# Altium schematic sheet jetson-nano.SchDoc
size A3
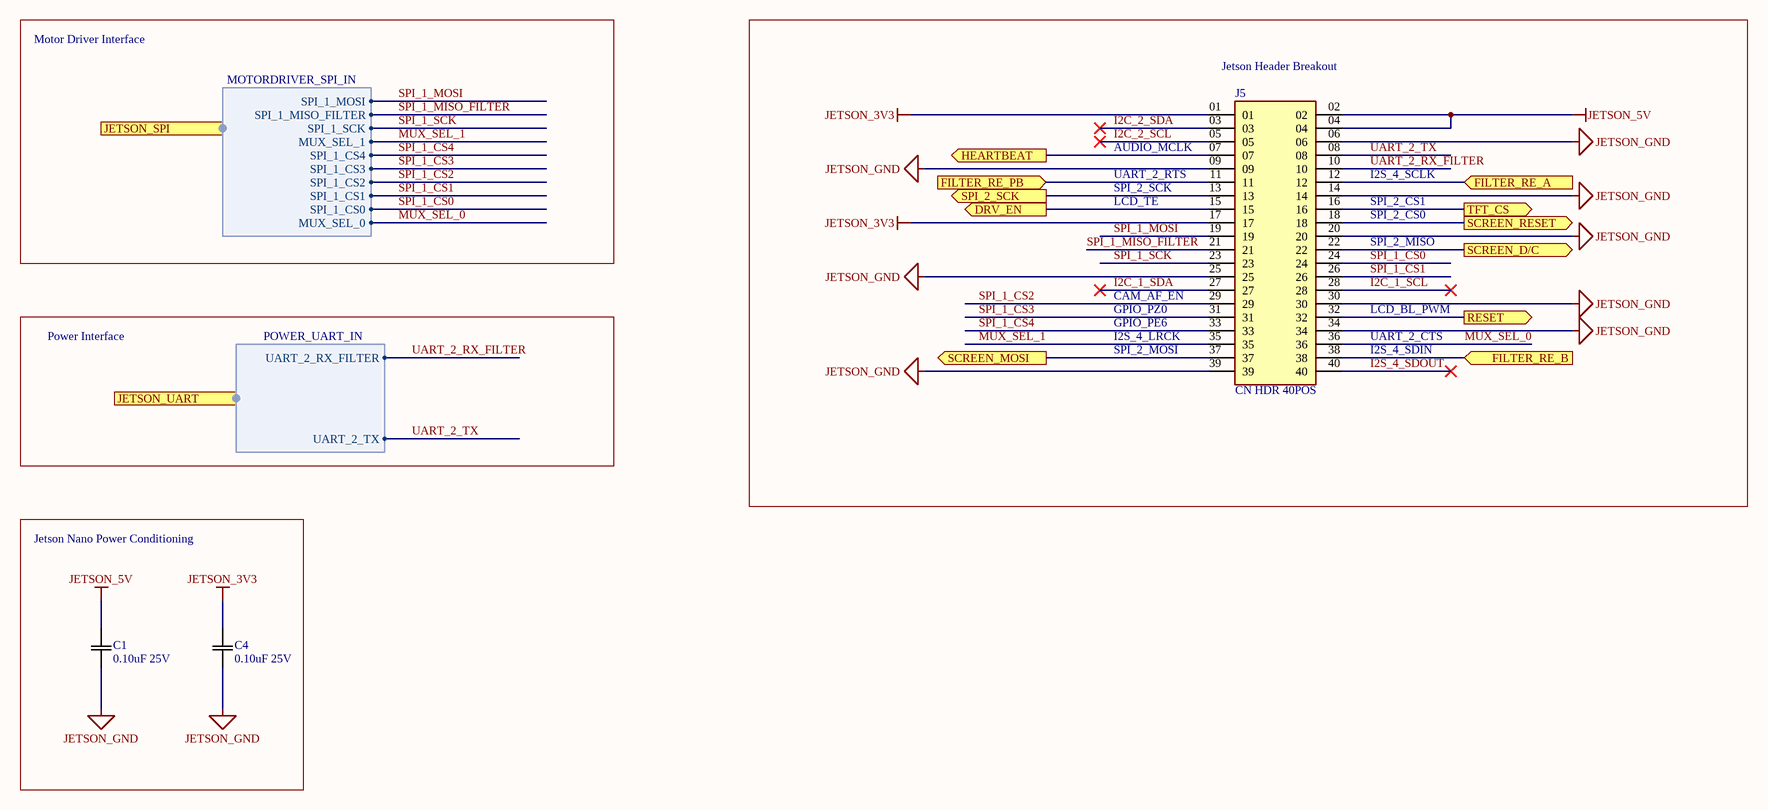
[diagram p0: jetson-nano.SchDoc]

## Parts
C1  0.10uF 25V  [0805]
C4  0.10uF 25V  [0805]
J5  CN HDR 40POS  [CN HDR 40POS 0.1 TH]

## Blocks framed on the sheet
Jetson Nano Power Conditioning: C1 C4

## Ports
DRV_EN (out), FILTER_RE_A (in), FILTER_RE_B (in), FILTER_RE_PB (in), HEARTBEAT (out), JETSON_SPI (harness MOTORDRIVER_SPI_IN), JETSON_UART (harness POWER_UART_IN), RESET (out), SCREEN_D/C (out), SCREEN_MOSI (out), SCREEN_RESET (out), SPI_2_SCK (out), TFT_CS (out)

## Harnesses
MOTORDRIVER_SPI_IN: SPI_1_CS0, MUX_SEL_1, SPI_1_MOSI, SPI_1_MISO_FILTER, SPI_1_CS1, SPI_1_CS2, SPI_1_CS3, SPI_1_CS4, SPI_1_SCK, MUX_SEL_0
POWER_UART_IN: UART_2_TX, UART_2_RX_FILTER

## Nets
JETSON_3V3: C4.2(C2) J5.01 J5.17
JETSON_5V: C1.2(C2) J5.02 J5.04
JETSON_GND: C1.1(C1) C4.1(C1) J5.06 J5.09 J5.14 J5.20 J5.25 J5.30 J5.34 J5.39
DRV_EN: J5.15 ; port DRV_EN
FILTER_RE_A: J5.12 ; port FILTER_RE_A
FILTER_RE_B: J5.38 ; port FILTER_RE_B
FILTER_RE_PB: J5.11 ; port FILTER_RE_PB
HEARTBEAT: J5.07 ; port HEARTBEAT
I2C_1_SCL: J5.28
I2C_1_SDA: J5.27
I2C_2_SCL: J5.05
I2C_2_SDA: J5.03
I2S_4_SDOUT: J5.40
MUX_SEL_0: J5.36 ; port JETSON_SPI.MUX_SEL_0
MUX_SEL_1: J5.35 ; port JETSON_SPI.MUX_SEL_1
RESET: J5.32 ; port RESET
SCREEN_D/C: J5.22 ; port SCREEN_D/C
SCREEN_MOSI: J5.37 ; port SCREEN_MOSI
SCREEN_RESET: J5.18 ; port SCREEN_RESET
SPI_1_CS0: J5.24 ; port JETSON_SPI.SPI_1_CS0
SPI_1_CS1: J5.26 ; port JETSON_SPI.SPI_1_CS1
SPI_1_CS2: J5.29 ; port JETSON_SPI.SPI_1_CS2
SPI_1_CS3: J5.31 ; port JETSON_SPI.SPI_1_CS3
SPI_1_CS4: J5.33 ; port JETSON_SPI.SPI_1_CS4
SPI_1_MISO_FILTER: J5.21 ; port JETSON_SPI.SPI_1_MISO_FILTER
SPI_1_MOSI: J5.19 ; port JETSON_SPI.SPI_1_MOSI
SPI_1_SCK: J5.23 ; port JETSON_SPI.SPI_1_SCK
SPI_2_SCK: J5.13 ; port SPI_2_SCK
TFT_CS: J5.16 ; port TFT_CS
UART_2_RX_FILTER: J5.10 ; port JETSON_UART.UART_2_RX_FILTER
UART_2_TX: J5.08 ; port JETSON_UART.UART_2_TX

## Notes on the sheet
- Motor Driver Interface
- (near J5) Jetson Header Breakout
- AUDIO_MCLK
- UART_2_RTS
- I2S_4_SCLK
- LCD_TE
- SPI_2_SCK
- SPI_2_CS1
- SPI_2_MISO
- SPI_2_CS0
- GPIO_PZ0
- CAM_AF_EN
- LCD_BL_PWM
- Power Interface
- SPI_2_MOSI
- I2S_4_LRCK
- GPIO_PE6
- I2S_4_SDIN
- UART_2_CTS

## Library data of the parts
C1 C4 = CAP 0.10uF 25V: CAP CER 0.10UF 25V X7R 0805; Value: 0.1uF; Tolerance: 10%; Temperature Coefficient: X7R; Rating: 25V; Part Number: CAP 0.10uF 25V; Operating Temperature: -55°C ~ 125°C
J5 = CN HDR 40POS: 40 Position Header Connector; Part Number: CN HDR 40POS; Supplier 1: Digi-Key; Supplier Part Number 1: S6104-ND; Supplier URL 1: https://www.digikey.ca/en/products/detail/sullins-connector-solutions/PPTC202LFBN-RC/807240?s=N4IgTCBcDaIMoDYCMAGALAWgHIBEQF0BfIA; Pin Count: 40